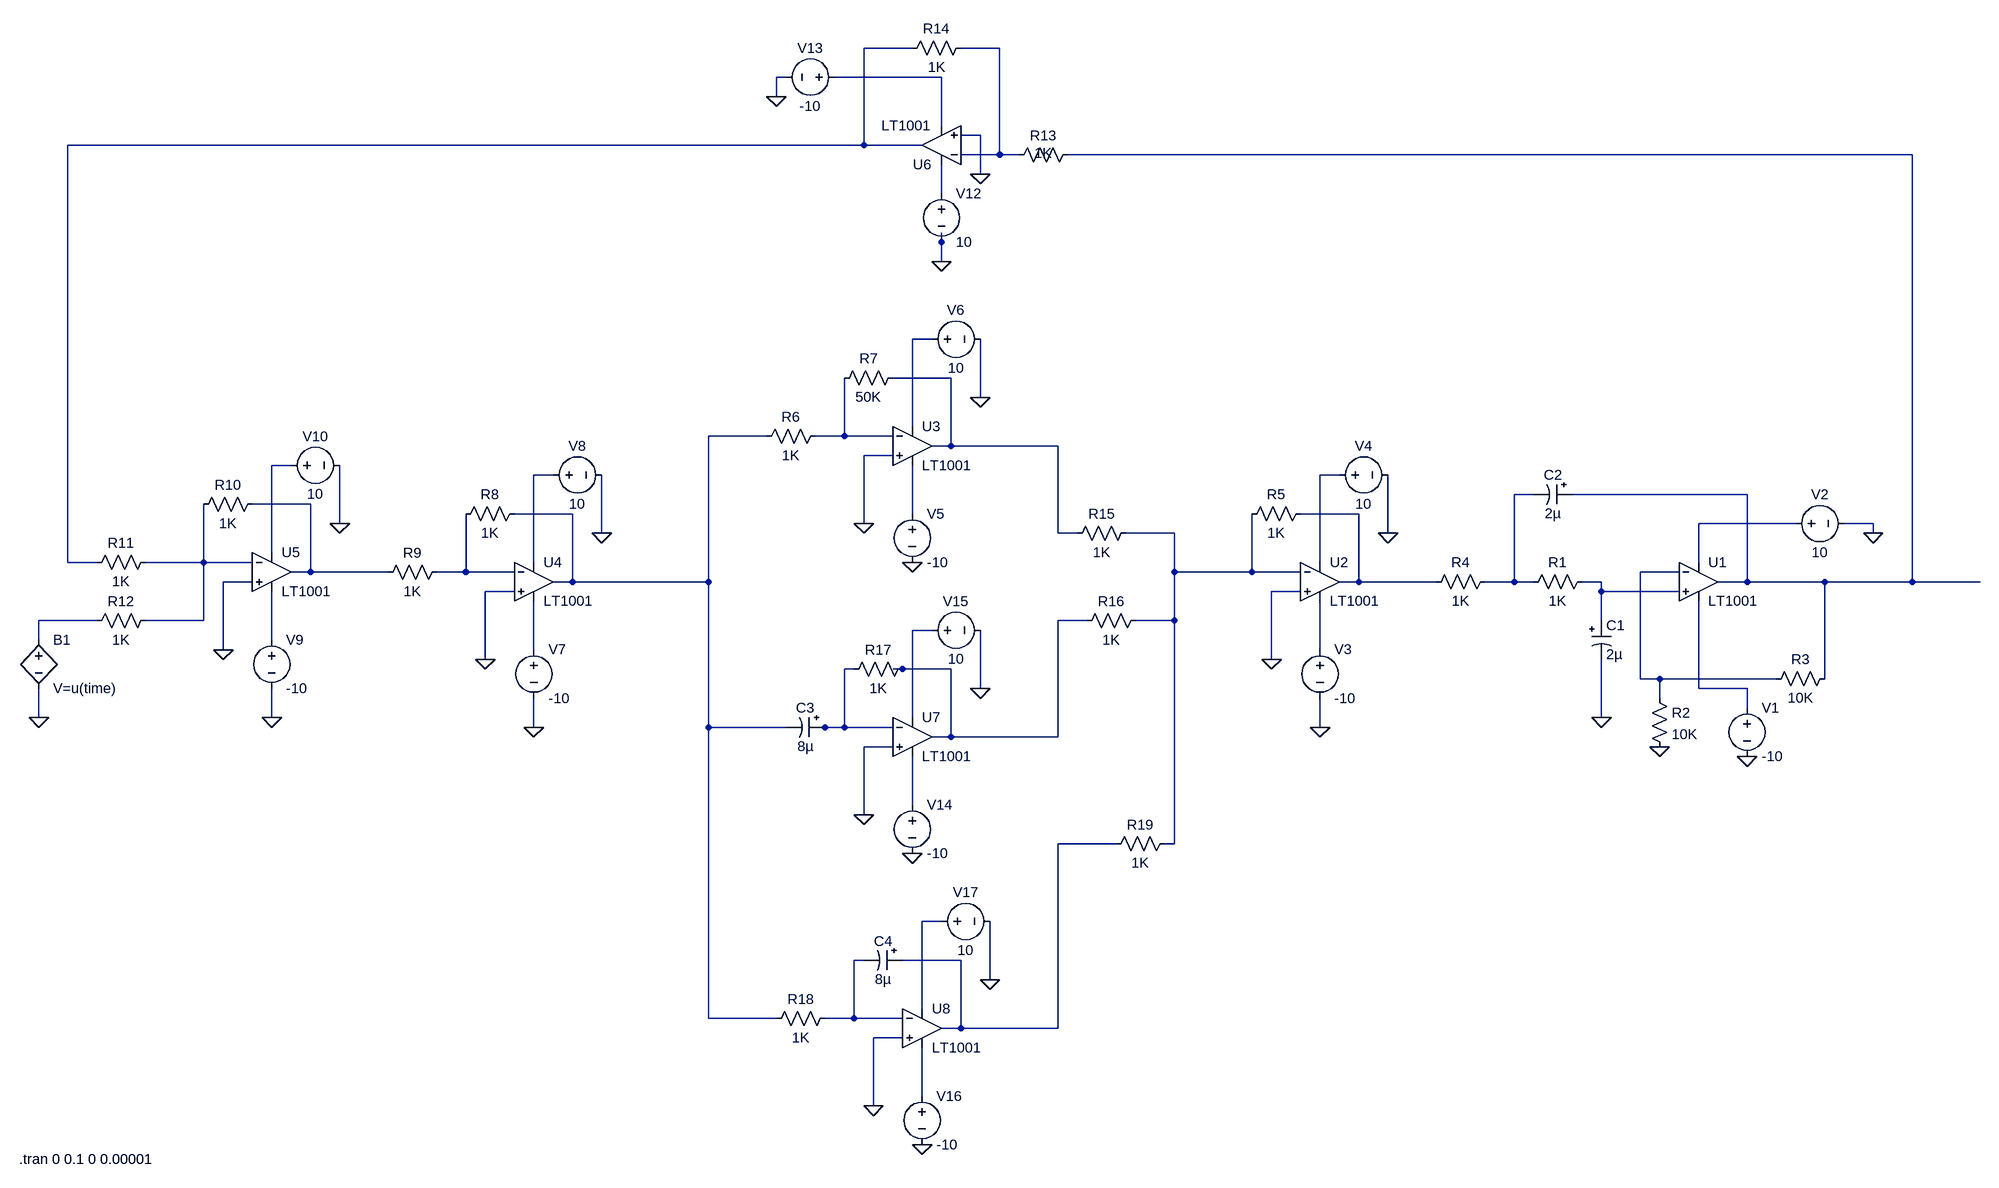
[diagram p0: schematic PID_controller.asc]
PID_controller.asc, the LTspice schematic file:
Version 4
SHEET 1 1828 1320
WIRE 64 -528 -16 -528
WIRE 208 -528 144 -528
WIRE -144 -480 -160 -480
WIRE 112 -480 -64 -480
WIRE -160 -448 -160 -480
WIRE 112 -400 112 -480
WIRE 176 -384 144 -384
WIRE -16 -368 -16 -528
WIRE -16 -368 -1328 -368
WIRE 80 -368 -16 -368
WIRE 208 -352 208 -528
WIRE 208 -352 144 -352
WIRE 240 -352 208 -352
WIRE 1712 -352 320 -352
WIRE 176 -320 176 -384
WIRE 112 -288 112 -336
WIRE 112 -208 112 -224
WIRE 112 -176 112 -208
WIRE 96 -48 64 -48
WIRE 128 16 32 16
WIRE 176 48 176 -48
WIRE 64 96 64 -48
WIRE -176 112 -272 112
WIRE -48 112 -48 16
WIRE -48 112 -96 112
WIRE 32 112 -48 112
WIRE 128 128 128 16
WIRE 128 128 96 128
WIRE 304 128 128 128
WIRE 32 144 -16 144
WIRE -960 160 -992 160
WIRE -528 176 -560 176
WIRE 768 176 736 176
WIRE 1088 208 1056 208
WIRE 1440 208 1152 208
WIRE -928 224 -1024 224
WIRE -496 240 -592 240
WIRE 64 240 64 160
WIRE 800 240 704 240
WIRE -880 256 -880 160
WIRE -16 256 -16 144
WIRE 1520 256 1360 256
WIRE 1648 256 1600 256
WIRE -448 272 -448 176
WIRE 304 272 304 128
WIRE 336 272 304 272
WIRE 496 272 416 272
WIRE 848 272 848 176
WIRE 1648 272 1648 256
WIRE -992 304 -992 160
WIRE -1328 320 -1328 -368
WIRE -1280 320 -1328 320
WIRE -1104 320 -1104 224
WIRE -1104 320 -1200 320
WIRE -1024 320 -1104 320
WIRE -560 320 -560 176
WIRE 736 320 736 176
WIRE 1360 320 1360 256
WIRE -928 336 -928 224
WIRE -928 336 -960 336
WIRE -800 336 -928 336
WIRE -672 336 -672 240
WIRE -672 336 -720 336
WIRE -592 336 -672 336
WIRE 496 336 496 272
WIRE 624 336 624 240
WIRE 624 336 496 336
WIRE 704 336 624 336
WIRE 1328 336 1264 336
WIRE -1024 352 -1072 352
WIRE -496 352 -496 240
WIRE -496 352 -528 352
WIRE -272 352 -272 112
WIRE -272 352 -496 352
WIRE 800 352 800 240
WIRE 800 352 768 352
WIRE 928 352 800 352
WIRE 1056 352 1056 208
WIRE 1056 352 1008 352
WIRE 1088 352 1056 352
WIRE 1200 352 1168 352
WIRE 1440 352 1440 208
WIRE 1440 352 1392 352
WIRE 1568 352 1440 352
WIRE 1712 352 1712 -352
WIRE 1712 352 1568 352
WIRE 1824 352 1712 352
WIRE -592 368 -640 368
WIRE 704 368 656 368
WIRE 1200 368 1200 352
WIRE 1328 368 1200 368
WIRE -1280 416 -1376 416
WIRE -1104 416 -1104 320
WIRE -1104 416 -1200 416
WIRE 352 416 304 416
WIRE 496 416 496 336
WIRE 496 416 432 416
WIRE 1200 416 1200 368
WIRE 96 432 64 432
WIRE -1376 448 -1376 416
WIRE -992 448 -992 368
WIRE -1072 464 -1072 352
WIRE -560 464 -560 384
WIRE 736 464 736 384
WIRE -640 480 -640 368
WIRE 656 480 656 368
WIRE -32 496 -48 496
WIRE 48 496 32 496
WIRE 128 496 48 496
WIRE 1264 512 1264 336
WIRE 1296 512 1264 512
WIRE 1488 512 1296 512
WIRE 1568 512 1568 352
WIRE 176 528 176 432
WIRE 1360 528 1360 384
WIRE 1440 528 1360 528
WIRE 1296 544 1296 512
WIRE 1440 560 1440 528
WIRE -1376 576 -1376 528
WIRE -992 576 -992 528
WIRE 64 576 64 432
WIRE 1200 576 1200 480
WIRE -560 592 -560 544
WIRE -272 592 -272 352
WIRE -144 592 -272 592
WIRE -80 592 -96 592
WIRE -48 592 -48 496
WIRE -48 592 -80 592
WIRE 32 592 -48 592
WIRE 736 592 736 544
WIRE 128 608 128 496
WIRE 128 608 96 608
WIRE 304 608 304 416
WIRE 304 608 128 608
WIRE 32 624 -16 624
WIRE 64 720 64 640
WIRE -16 736 -16 624
WIRE 400 784 304 784
WIRE 496 784 496 416
WIRE 496 784 480 784
WIRE 112 912 80 912
WIRE -16 976 -32 976
WIRE 144 976 48 976
WIRE 192 1008 192 912
WIRE 80 1056 80 912
WIRE -272 1072 -272 592
WIRE -160 1072 -272 1072
WIRE -32 1072 -32 976
WIRE -32 1072 -80 1072
WIRE 48 1072 -32 1072
WIRE 144 1088 144 976
WIRE 144 1088 112 1088
WIRE 304 1088 304 784
WIRE 304 1088 144 1088
WIRE 48 1104 0 1104
WIRE 80 1200 80 1120
WIRE 0 1216 0 1104
FLAG 1296 624 0
FLAG 1200 576 0
FLAG 1440 640 0
FLAG 1648 272 0
FLAG 848 272 0
FLAG 736 592 0
FLAG 656 480 0
FLAG 176 48 0
FLAG 64 320 0
FLAG -16 256 0
FLAG -448 272 0
FLAG -560 592 0
FLAG -640 480 0
FLAG -880 256 0
FLAG -992 576 0
FLAG -1072 464 0
FLAG -1376 576 0
FLAG 112 -176 0
FLAG -160 -448 0
FLAG 176 528 0
FLAG 64 800 0
FLAG -16 736 0
FLAG 192 1008 0
FLAG 80 1280 0
FLAG 0 1216 0
FLAG 176 -320 0
SYMBOL voltage 1440 544 R0
WINDOW 123 0 0 Left 0
WINDOW 39 0 0 Left 0
SYMATTR InstName V1
SYMATTR Value -10
SYMBOL voltage 1504 256 R270
WINDOW 0 32 56 VTop 2
WINDOW 3 -32 56 VBottom 2
WINDOW 123 0 0 Left 0
WINDOW 39 0 0 Left 0
SYMATTR InstName V2
SYMATTR Value 10
SYMBOL res 1184 336 R90
WINDOW 0 0 56 VBottom 2
WINDOW 3 32 56 VTop 2
SYMATTR InstName R1
SYMATTR Value 1K
SYMBOL polcap 1184 416 R0
SYMATTR InstName C1
SYMATTR Value 2µ
SYMBOL polcap 1152 192 R90
WINDOW 0 0 32 VBottom 2
WINDOW 3 32 32 VTop 2
SYMATTR InstName C2
SYMATTR Value 2µ
SYMBOL OpAmps\\LT1001 1360 288 R0
SYMATTR InstName U1
SYMBOL res 1280 528 R0
SYMATTR InstName R2
SYMATTR Value 10K
SYMBOL res 1584 496 R90
WINDOW 0 0 56 VBottom 2
WINDOW 3 32 56 VTop 2
SYMATTR InstName R3
SYMATTR Value 10K
SYMBOL OpAmps\\LT1001 736 288 R0
SYMATTR InstName U2
SYMBOL voltage 736 448 R0
WINDOW 123 0 0 Left 0
WINDOW 39 0 0 Left 0
SYMATTR InstName V3
SYMATTR Value -10
SYMBOL voltage 752 176 R270
WINDOW 0 32 56 VTop 2
WINDOW 3 -32 56 VBottom 2
WINDOW 123 0 0 Left 0
WINDOW 39 0 0 Left 0
SYMATTR InstName V4
SYMATTR Value 10
SYMBOL res 1024 336 R90
WINDOW 0 0 56 VBottom 2
WINDOW 3 32 56 VTop 2
SYMATTR InstName R4
SYMATTR Value 1K
SYMBOL res 720 224 R90
WINDOW 0 0 56 VBottom 2
WINDOW 3 32 56 VTop 2
SYMATTR InstName R5
SYMATTR Value 1K
SYMBOL OpAmps\\LT1001 64 64 R0
SYMATTR InstName U3
SYMBOL voltage 64 224 R0
WINDOW 123 0 0 Left 0
WINDOW 39 0 0 Left 0
SYMATTR InstName V5
SYMATTR Value -10
SYMBOL voltage 80 -48 R270
WINDOW 0 32 56 VTop 2
WINDOW 3 -32 56 VBottom 2
WINDOW 123 0 0 Left 0
WINDOW 39 0 0 Left 0
SYMATTR InstName V6
SYMATTR Value 10
SYMBOL res -80 96 R90
WINDOW 0 0 56 VBottom 2
WINDOW 3 32 56 VTop 2
SYMATTR InstName R6
SYMATTR Value 1K
SYMBOL res 48 0 R90
WINDOW 0 0 56 VBottom 2
WINDOW 3 32 56 VTop 2
SYMATTR InstName R7
SYMATTR Value 50K
SYMBOL OpAmps\\LT1001 -560 288 R0
SYMATTR InstName U4
SYMBOL voltage -560 448 R0
WINDOW 123 0 0 Left 0
WINDOW 39 0 0 Left 0
SYMATTR InstName V7
SYMATTR Value -10
SYMBOL voltage -544 176 R270
WINDOW 0 32 56 VTop 2
WINDOW 3 -32 56 VBottom 2
WINDOW 123 0 0 Left 0
WINDOW 39 0 0 Left 0
SYMATTR InstName V8
SYMATTR Value 10
SYMBOL res -576 224 R90
WINDOW 0 0 56 VBottom 2
WINDOW 3 32 56 VTop 2
SYMATTR InstName R8
SYMATTR Value 1K
SYMBOL OpAmps\\LT1001 -992 272 R0
SYMATTR InstName U5
SYMBOL voltage -992 432 R0
WINDOW 123 0 0 Left 0
WINDOW 39 0 0 Left 0
SYMATTR InstName V9
SYMATTR Value -10
SYMBOL voltage -976 160 R270
WINDOW 0 32 56 VTop 2
WINDOW 3 -32 56 VBottom 2
WINDOW 123 0 0 Left 0
WINDOW 39 0 0 Left 0
SYMATTR InstName V10
SYMATTR Value 10
SYMBOL res -704 320 R90
WINDOW 0 0 56 VBottom 2
WINDOW 3 32 56 VTop 2
SYMATTR InstName R9
SYMATTR Value 1K
SYMBOL res -1008 208 R90
WINDOW 0 0 56 VBottom 2
WINDOW 3 32 56 VTop 2
SYMATTR InstName R10
SYMATTR Value 1K
SYMBOL res -1184 304 R90
WINDOW 0 0 56 VBottom 2
WINDOW 3 32 56 VTop 2
SYMATTR InstName R11
SYMATTR Value 1K
SYMBOL res -1184 400 R90
WINDOW 0 0 56 VBottom 2
WINDOW 3 32 56 VTop 2
SYMATTR InstName R12
SYMATTR Value 1K
SYMBOL OpAmps\\LT1001 112 -304 R180
SYMATTR InstName U6
SYMBOL res 336 -368 R90
WINDOW 0 0 56 VBottom 2
WINDOW 3 -2 56 VTop 2
SYMATTR InstName R13
SYMATTR Value 1K
SYMBOL res 160 -544 R90
WINDOW 0 0 56 VBottom 2
WINDOW 3 32 56 VTop 2
SYMATTR InstName R14
SYMATTR Value 1K
SYMBOL voltage 112 -304 R0
WINDOW 123 0 0 Left 0
WINDOW 39 0 0 Left 0
SYMATTR InstName V12
SYMATTR Value 10
SYMBOL voltage -48 -480 R90
WINDOW 0 -32 56 VBottom 2
WINDOW 3 32 56 VTop 2
WINDOW 123 0 0 Left 0
WINDOW 39 0 0 Left 0
SYMATTR InstName V13
SYMATTR Value -10
SYMBOL OpAmps\\LT1001 64 544 R0
SYMATTR InstName U7
SYMBOL voltage 64 704 R0
WINDOW 123 0 0 Left 0
WINDOW 39 0 0 Left 0
SYMATTR InstName V14
SYMATTR Value -10
SYMBOL voltage 80 432 R270
WINDOW 0 32 56 VTop 2
WINDOW 3 -32 56 VBottom 2
WINDOW 123 0 0 Left 0
WINDOW 39 0 0 Left 0
SYMATTR InstName V15
SYMATTR Value 10
SYMBOL res 432 256 R90
WINDOW 0 0 56 VBottom 2
WINDOW 3 32 56 VTop 2
SYMATTR InstName R15
SYMATTR Value 1K
SYMBOL res 448 400 R90
WINDOW 0 0 56 VBottom 2
WINDOW 3 32 56 VTop 2
SYMATTR InstName R16
SYMATTR Value 1K
SYMBOL res 64 480 R90
WINDOW 0 0 56 VBottom 2
WINDOW 3 32 56 VTop 2
SYMATTR InstName R17
SYMATTR Value 1K
SYMBOL polcap -80 576 R90
WINDOW 0 0 32 VBottom 2
WINDOW 3 32 32 VTop 2
SYMATTR InstName C3
SYMATTR Value 8µ
SYMBOL res -64 1056 R90
WINDOW 0 0 56 VBottom 2
WINDOW 3 32 56 VTop 2
SYMATTR InstName R18
SYMATTR Value 1K
SYMBOL OpAmps\\LT1001 80 1024 R0
SYMATTR InstName U8
SYMBOL voltage 80 1184 R0
WINDOW 123 0 0 Left 0
WINDOW 39 0 0 Left 0
SYMATTR InstName V16
SYMATTR Value -10
SYMBOL voltage 96 912 R270
WINDOW 0 32 56 VTop 2
WINDOW 3 -32 56 VBottom 2
WINDOW 123 0 0 Left 0
WINDOW 39 0 0 Left 0
SYMATTR InstName V17
SYMATTR Value 10
SYMBOL polcap 48 960 R90
WINDOW 0 0 32 VBottom 2
WINDOW 3 32 32 VTop 2
SYMATTR InstName C4
SYMATTR Value 8µ
SYMBOL res 496 768 R90
WINDOW 0 0 56 VBottom 2
WINDOW 3 32 56 VTop 2
SYMATTR InstName R19
SYMATTR Value 1K
SYMBOL bv -1376 432 R0
SYMATTR InstName B1
SYMATTR Value V=u(time)
TEXT -1408 1304 Left 2 !.tran 0 0.1 0 0.00001

The netlist it stands for:
* PID_controller.asc
V1 N030 0 -10
V2 N017 0 10
R1 N022 N013 1K
C1 N022 0 2µ
C2 N004 N013 2µ
XU1 N022 N021 N017 N030 N004 LT1001  ; pins In+ In- V+ V- OUT
R2 N021 0 10K
R3 N004 N021 10K
XU2 0 N018 N012 N028 N016 LT1001  ; pins In+ In- V+ V- OUT
V3 N028 0 -10
V4 N012 0 10
R4 N013 N016 1K
R5 N016 N018 1K
XU3 0 N009 N006 N015 N007 LT1001  ; pins In+ In- V+ V- OUT
V5 N015 0 -10
V6 N006 0 10
R6 N009 N008 1K
R7 N007 N009 50K
XU4 0 N020 N011 N027 N008 LT1001  ; pins In+ In- V+ V- OUT
V7 N027 0 -10
V8 N011 0 10
R8 N008 N020 1K
XU5 0 N019 N010 N026 N014 LT1001  ; pins In+ In- V+ V- OUT
V9 N026 0 -10
V10 N010 0 10
R9 N020 N014 1K
R10 N014 N019 1K
R11 N019 N001 1K
R12 N019 N023 1K
XU6 0 N002 N005 N003 N001 LT1001  ; pins In+ In- V+ V- OUT
R13 N004 N002 1K
R14 N002 N001 1K
V12 N005 0 10
V13 N003 0 -10
XU7 0 N029 N025 N031 N024 LT1001  ; pins In+ In- V+ V- OUT
V14 N031 0 -10
V15 N025 0 10
R15 N018 N007 1K
R16 N018 N024 1K
R17 N024 N029 1K
C3 N029 N008 8µ
R18 N034 N008 1K
XU8 0 N034 N033 N035 N032 LT1001  ; pins In+ In- V+ V- OUT
V16 N035 0 -10
V17 N033 0 10
C4 N032 N034 8µ
R19 N018 N032 1K
B1 N023 0 V=u(time)
.tran 0 0.1 0 0.00001
.lib LTC.lib
.backanno
.end